# Altium schematic sheet Top-Level.SchDoc
size A; SheetNumber: 1; SheetTotal: 8
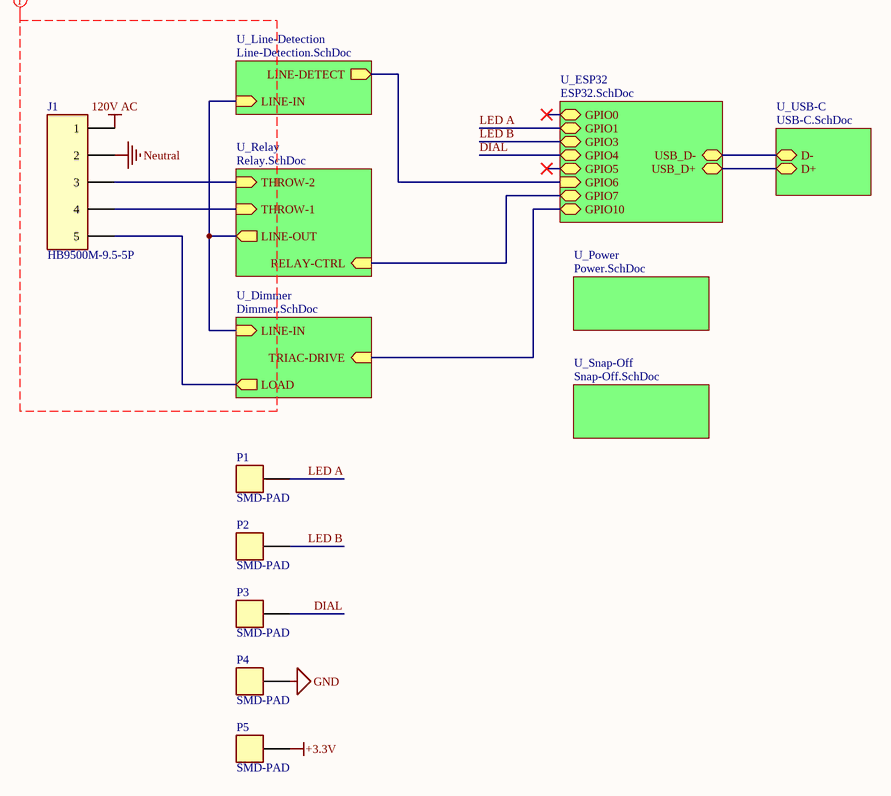
[diagram p0: Top-Level.SchDoc]

## Parts
J1  HB9500M-9.5-5P  [CONN-TH_HB9500M-9.5-5P]
P1  SMD-PAD  [USER_SMD-PAD]  (no BOM)
P2  SMD-PAD  [USER_SMD-PAD]  (no BOM)
P3  SMD-PAD  [USER_SMD-PAD]  (no BOM)
P4  SMD-PAD  [USER_SMD-PAD]  (no BOM)
P5  SMD-PAD  [USER_SMD-PAD]  (no BOM)

## Sub-sheets
U_Dimmer = Dimmer.SchDoc: LOAD (out), TRIAC-DRIVE (in), LINE-IN (in)
U_ESP32 = ESP32.SchDoc: USB_D- (bidir), USB_D+ (bidir), GPIO10 (bidir), GPIO7 (bidir), GPIO6 (in), GPIO3 (bidir), GPIO4 (bidir), GPIO5 (bidir), GPIO0 (bidir), GPIO1 (bidir)
U_Line-Detection = Line-Detection.SchDoc: LINE-IN (in), LINE-DETECT (out)
U_Power = Power.SchDoc: no entries
U_Relay = Relay.SchDoc: RELAY-CTRL (in), THROW-1 (in), THROW-2 (in), LINE-OUT (out)
U_Snap-Off = Snap-Off.SchDoc: no entries
U_USB-C = USB-C.SchDoc: D- (bidir), D+ (bidir)

## Nets
120V AC: J1.1
+3.3V: P5.1
GND: P4.1
Neutral: J1.2
DIAL: P3.1 ; sheet U_ESP32/GPIO4
LED A: P1.1 ; sheet U_ESP32/GPIO1
LED B: P2.1 ; sheet U_ESP32/GPIO3
NetJ1_3: J1.3 ; sheet U_Relay/THROW-2
NetJ1_4: J1.4 ; sheet U_Relay/THROW-1
NetJ1_5: J1.5 ; sheet U_Dimmer/LOAD
(unnamed): sheet U_ESP32/USB_D-, sheet U_USB-C/D-
(unnamed): sheet U_ESP32/USB_D+, sheet U_USB-C/D+
(unnamed): sheet U_ESP32/GPIO10, sheet U_Dimmer/TRIAC-DRIVE
(unnamed): sheet U_ESP32/GPIO7, sheet U_Relay/RELAY-CTRL
(unnamed): sheet U_ESP32/GPIO6, sheet U_Line-Detection/LINE-DETECT
(unnamed): sheet U_Relay/LINE-OUT, sheet U_Dimmer/LINE-IN, sheet U_Line-Detection/LINE-IN

## Layout directives
net class High-Voltage: 120V AC, Neutral

## Library data of the parts
J1 = HB9500M-9.5-5P: 1x5P Side Mount With Cover Plate 5 1 9.5mm -40℃~+105℃ 32A 750V Black 12~22 Straight Pin 4 Through Hole,P=9.5mm Barrier Terminal Blocks ROHS; LCSC Part Number: C601240
P1-P5 = SMD-PAD: SMD Pad for 18-22 AWG wire